# Altium project WT-32 V3.2.PrjPcb (part 1 of 4)
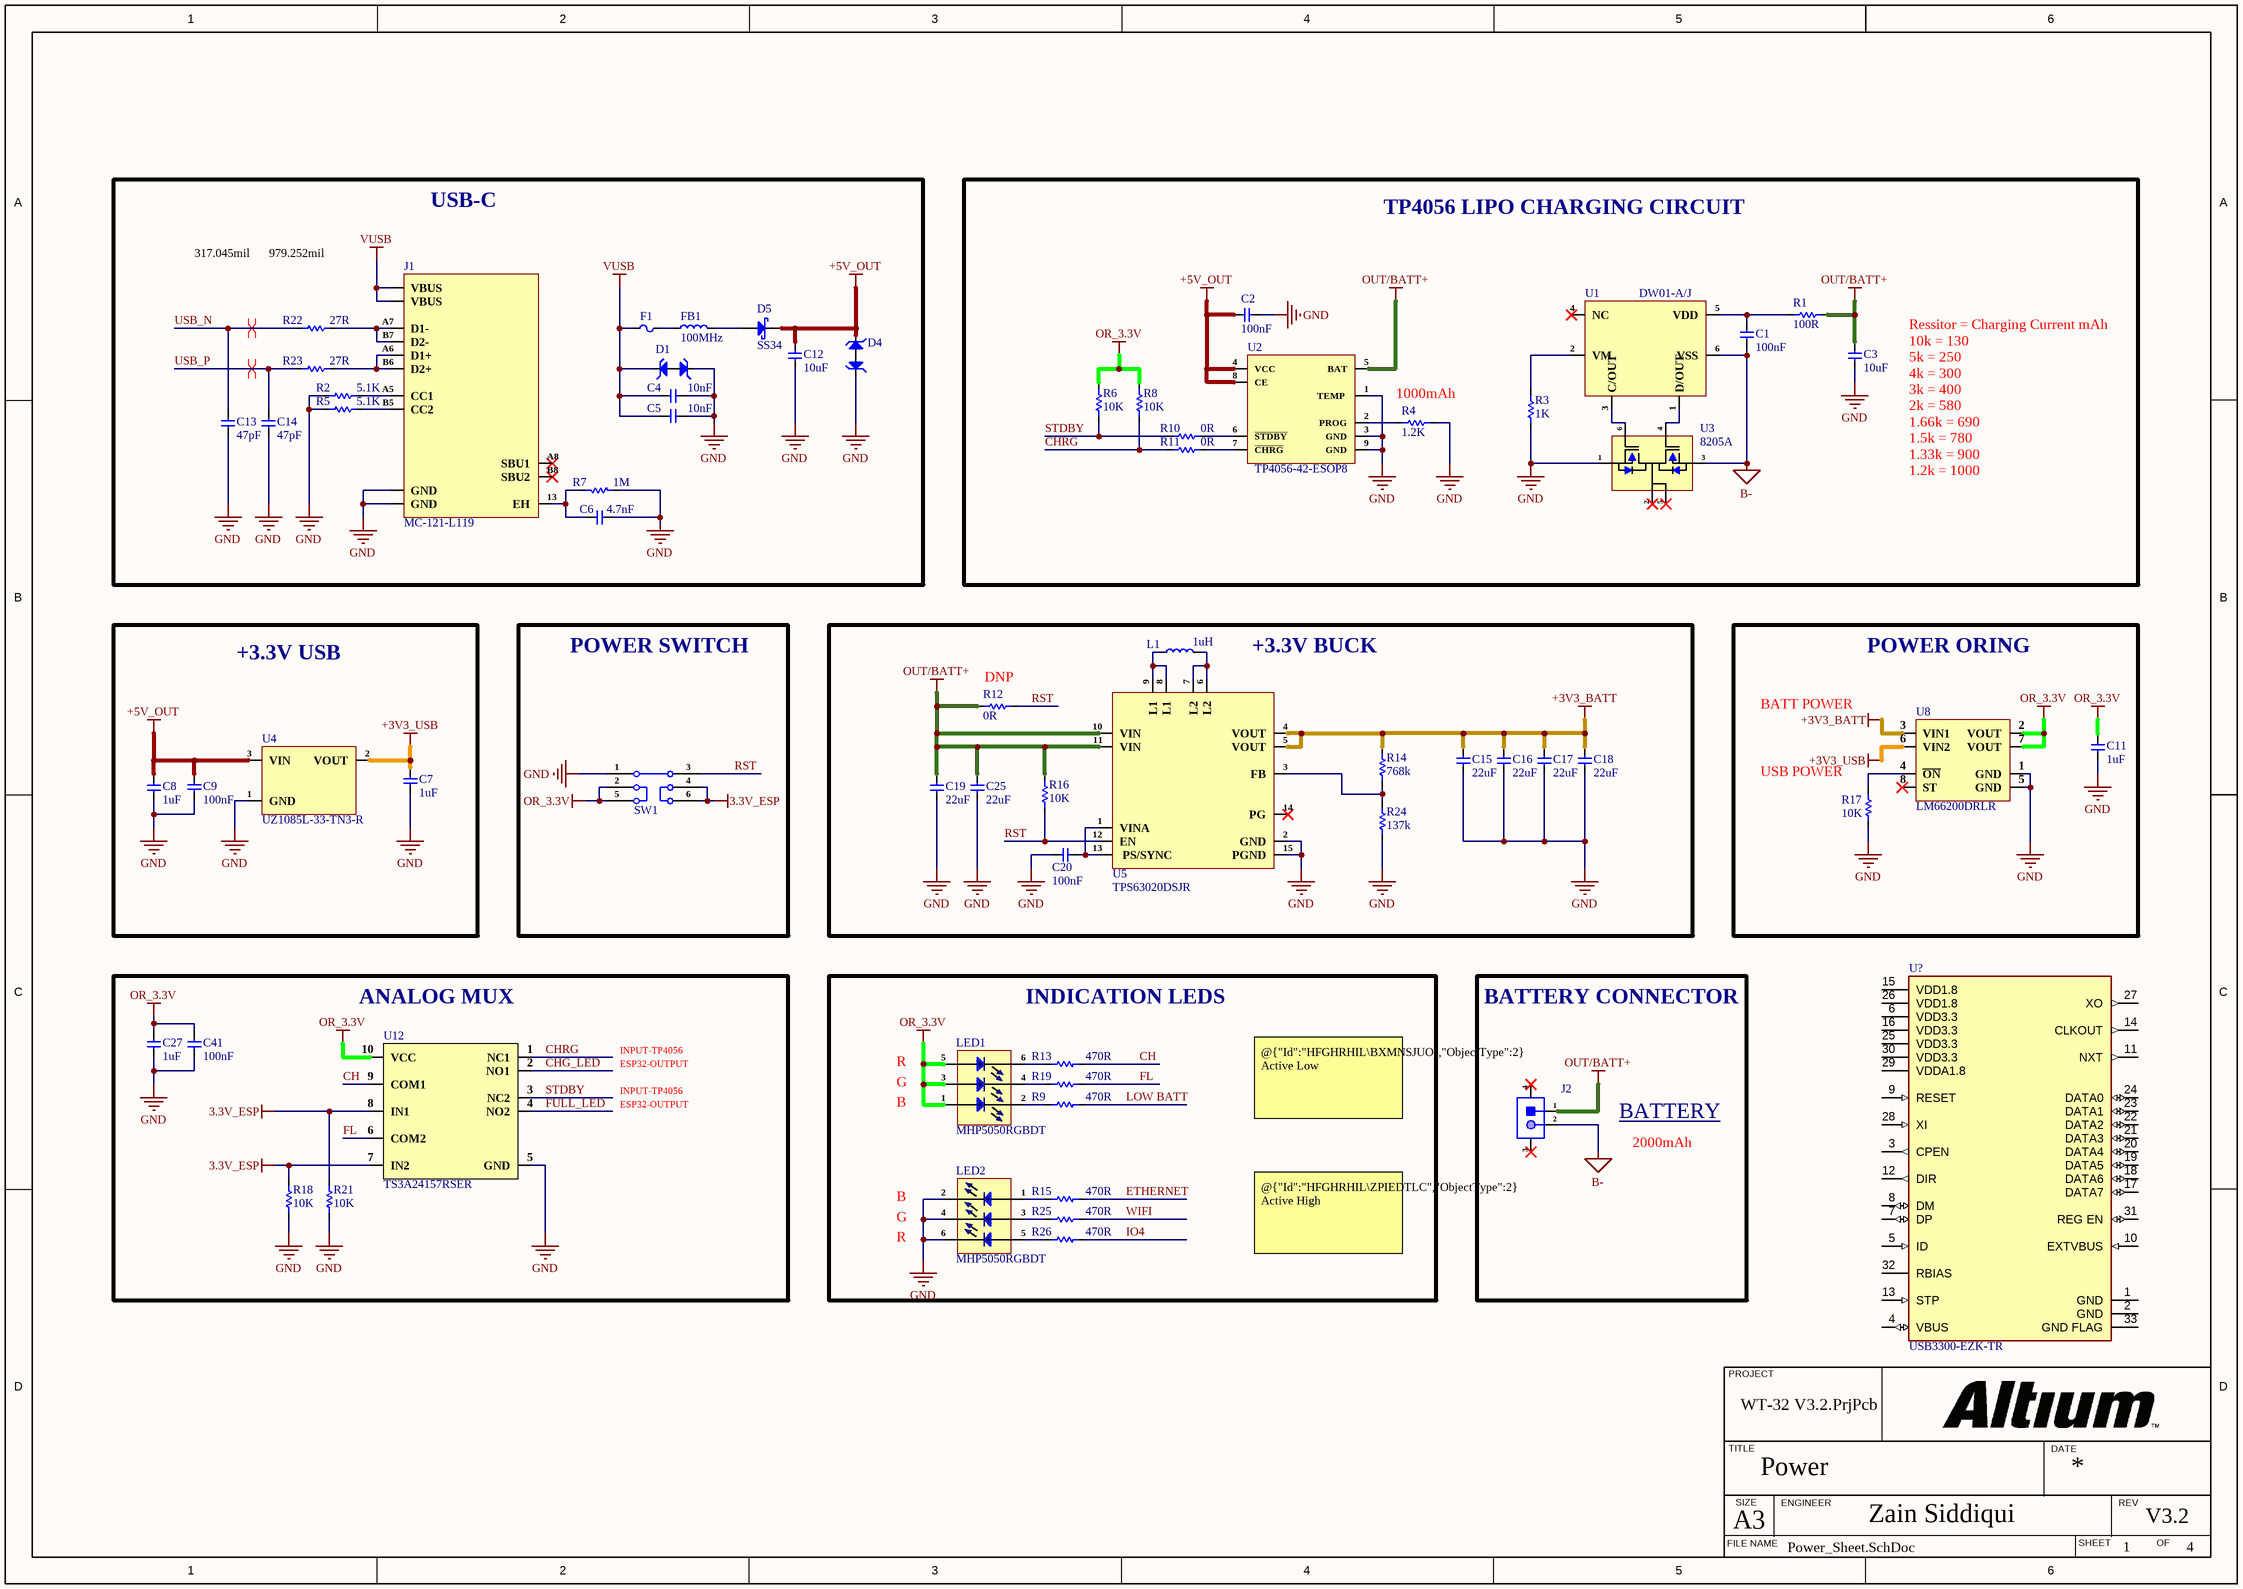
[diagram p0: Power_Sheet.SchDoc]
4 sheets, 124 parts. Net scope: global (net labels, ports and power ports of the same name join across sheets).
Board file: Webbie-V3.2.PcbDoc
Sheets:
  Power_Sheet.SchDoc
  Controller_Sheet.SchDoc
  Ethernet_Sheet.SchDoc
  FuelGauge_Sheet.SchDoc

## Sheet Power_Sheet.SchDoc: Power
size 420 x 297 mm; Engineer: Zain Siddiqui; Revision: V3.2; SheetNumber: 1; SheetTotal: 4

### Parts
C1  100nF  [cap-0402]
C2  100nF  [cap-0402]
C3  10uF  [Cap-0402]
C4  10nF  [Cap-0402]
C5  10nF  [Cap-0402]
C6  4.7nF  [Cap-0402]
C7  1uF  [Cap-0402]
C8  1uF  [Cap-0402]
C9  100nF  [cap-0402]
C11  1uF  [Cap-0402]
C12  10uF  [Cap-0603]
C13  47pF  [Cap-0402]
C14  47pF  [Cap-0402]
C15  22uF  [Cap-0805]
C16  22uF  [Cap-0805]
C17  22uF  [Cap-0805]
C18  22uF  [Cap-0805]
C19  22uF  [Cap-0805]
C20  100nF  [cap-0402]
C25  22uF  [Cap-0805]
C27  1uF  [Cap-0402]
C41  100nF  [cap-0402]
D1  PESD5V0H1BSFYL  [DSN0603-2]  (value not drawn)
D4  PESD5V0H1BSFYL  [DSN0603-2]  (value not drawn)
D5  SS34  [SMA]
F1  BSMD0805L-200  [Fuse-0805]  (value not drawn)
FB1  100MHz  [IND-1206]
J1  MC-121-L119  [MC-121-L119]
J2  S2B-PH-SM4-TB(LF)(SN)  [S2B-PH-SM4-TB(LF)(SN)]  (value not drawn)
L1  1uH  [IND-1008 (2520 Metric)]
LED1  MHP5050RGBDT  [MHP5050RGBDT]
LED2  MHP5050RGBDT  [MHP5050RGBDT]
R1  100R  [RES-0805]
R2  5.1K  [Res-0402]
R3  1K  [Res-0402]
R4  1.2K  [Res-0402]
R5  5.1K  [Res-0402]
R6  10K  [Res-0402]
R7  1M  [Res-0402]
R8  10K  [Res-0402]
R9  470R  [Res-0402]
R10  0R  [Res-0402]
R11  0R  [Res-0402]
R12  0R  [Res-0402]  (no BOM)
R13  470R  [Res-0402]
R14  768k  [Res-0402]
R15  470R  [Res-0402]
R16  10K  [Res-0603]
R17  10K  [Res-0402]
R18  10K  [Res-0402]
R19  470R  [Res-0402]
R21  10K  [Res-0402]
R22  27R  [Res-0402]
R23  27R  [Res-0402]
R24  137k  [Res-0402]
R25  470R  [Res-0402]
R26  470R  [Res-0402]
SW1  TK-6580A8-1  [TK-6580A8-1]  (value not drawn)
U1  DW01-A/J  [SOT-23-6]
U2  TP4056-42-ESOP8  [ESOP-8]
U3  8205A  [SOT-23-6]
U4  UZ1085L-33-TN3-R  [TO-252-2(DPAK)]
U5  TPS63020DSJR  [14-VSON (4x3)]
U8  LM66200DRLR  [SOT8]
U12  TS3A24157RSER  [UQFN-10(1.5x2)]
U?  USB3300-EZK-TR  [FP-32QFN-3304-5X5B-MFG]

### Blocks framed on the sheet
USB-C: C4-C6 C12-C14 D1 D4 D5 F1 FB1 J1 R2 R5 R7 R22 R23
TP4056 LIPO CHARGING CIRCUIT: C1-C3 R1 R3 R4 R6 R8 R10 R11 U1-U3
+3.3V USB: C7-C9 U4
POWER SWITCH: SW1
+3.3V BUCK: C15-C20 C25 L1 R12 R14 R16 R24 U5
POWER ORING: C11 R17 U8
ANALOG MUX: C27 C41 R18 R21 U12
INDICATION LEDS: LED1 LED2 R9 R13 R15 R19 R25 R26

### Nets
3.3V_ESP: R18.1 R21.1 SW1.4 SW1.6 U12.7(IN2) U12.8(IN1)
+3V3_BATT: C15.2 C16.2 C17.2 C18.2 R14.2 U5.4(VOUT) U5.5(VOUT) U8.3(VIN1)
+3V3_USB: C7.2 U4.2(VOUT) U8.6(VIN2)
+5V_OUT: C2.1 C8.2 C9.1 C12.2 D4.2 D5.1(K) U2.4(VCC) U2.8(CE) U4.3(VIN)
B-: C1.2 J2.2 U1.6(VSS) U3.3(S2)
GND: C2.2 C3.1 C4.2 C5.2 C6.1 C7.1 C8.1 C9.2 C11.1 C12.1 C13.1 C14.1 C15.1 C16.1 C17.1 C18.1 C19.1 C20.2 C25.1 C27.1 C41.1 D1.2 D4.1 J1.A1B12(GND) J1.B1A12(GND) LED2.2 LED2.4 LED2.6 R2.1 R3.1 R4.2 R5.1 R7.1 R17.2 R18.2 R21.2 R24.1 SW1.1 U2.1(TEMP) U2.3(GND) U2.9(GND) U3.1(S1) U4.1(GND) U5.2(GND) U5.15(PGND) U8.1(GND) U8.5(GND) U12.5(GND)
OR_3.3V: C11.2 C27.2 C41.2 LED1.1 LED1.3 LED1.5 R6.2 R8.2 SW1.2 SW1.5 U8.2(VOUT) U8.7(VOUT) U12.10(VCC)
OUT/BATT+: C3.2 C19.2 C25.2 J2.1 R1.2 R12.1 R16.2 U2.5(BAT) U5.10(VIN) U5.11(VIN)
VUSB: C4.1 C5.1 D1.1 F1.1 J1.A4B9(VBUS) J1.B4A9(VBUS)
CH: R13.1 U12.9(COM1)
CHG_LED: U12.2(NO1)
CHRG: R8.1 R11.1 U12.1(NC1)
ETHERNET: R15.1
FL: R19.1 U12.6(COM2)
FULL_LED: U12.4(NO2)
IO4: R26.1
LOW BATT: R9.1
RST: R12.2 R16.1 SW1.3 U5.12(EN)
STDBY: R6.1 R10.1 U12.3(NC2)
USB_N: C13.2 R22.1
USB_P: C14.2 R23.1
WIFI: R25.1
NetC1_1: C1.1 R1.1 U1.5(VDD)
NetC6_2: C6.2 J1.13(EH) R7.2
NetC20_1: C20.1 U5.1(VINA) U5.13(PS/SYNC)
NetD5_2: D5.2(A) FB1.2
NetF1_2: F1.2 FB1.1
NetJ1_A5: J1.A5(CC1) R2.2
NetJ1_A6: J1.A6(D1+) J1.B6(D2+) R23.2
NetJ1_A7: J1.A7(D1-) J1.B7(D2-) R22.2
NetJ1_B5: J1.B5(CC2) R5.2
NetL1_1: L1.1 U5.8(L1) U5.9(L1)
NetL1_2: L1.2 U5.6(L2) U5.7(L2)
NetLED1_2: LED1.2 R9.2
NetLED1_4: LED1.4 R19.2
NetLED1_6: LED1.6 R13.2
NetLED2_1: LED2.1 R15.2
NetLED2_3: LED2.3 R25.2
NetLED2_5: LED2.5 R26.2
NetR3_2: R3.2 U1.2(VM)
NetR4_1: R4.1 U2.2(PROG)
NetR10_2: R10.2 U2.6(~{STDBY})
NetR11_2: R11.2 U2.7(~{CHRG})
NetR14_1: R14.1 R24.2 U5.3(FB)
NetR17_1: R17.1 U8.4(~{ON})
NetU1_1: U1.1(D/OUT) U3.4(G2)
NetU1_3: U1.3(C/OUT) U3.6(G1)

Not connected (* = marked no-connect by the designer): J1 A8(SBU1)* B8(SBU2)*; J2 3* 4*; U1 4(NC)*; U3 2(D)* 5(D)*; U5 14(PG)*; U8 8(ST)*; U? 1(GND) 2(GND) 3(CPEN) 4(VBUS) 5(ID) 6(VDD3.3) 7(DP) 8(DM) 9(RESET) 10(EXTVBUS) 11(NXT) 12(DIR) 13(STP) 14(CLKOUT) 15(VDD1.8) 16(VDD3.3) 17(DATA7) 18(DATA6) 19(DATA5) 20(DATA4) 21(DATA3) 22(DATA2) 23(DATA1) 24(DATA0) 25(VDD3.3) 26(VDD1.8) 27(XO) 28(XI) 29(VDDA1.8) 30(VDD3.3) 31(REG_EN) 32(RBIAS) 33(GND_FLAG)

### Layout directives
differential pair; net class USB 90 OHM; differential pair class USB_Lines; rule Matched Net Lengths [Tolerance = 50mil]; rule Impedance Constraint [Min = 85.00    Max = 95.00    ]: USB_N, USB_P

### Notes on the sheet
- 317.045mil
- 979.252mil
- (near R4) 1000mAh
- Ressitor = Charging Current mAh
  10k = 130
  5k = 250
  4k = 300
  3k = 400
  2k = 580
  1.66k = 690
  1.5k = 780
  1.33k = 900
  1.2k = 1000
- (near R12) DNP
- BATT POWER
- (near R17) USB POWER
- BATTERY CONNECTOR
- INPUT-TP4056
- ESP32-OUTPUT
- (near LED1) R
- (near LED1) G
- (near LED1) B
- @{"Id":"HFGHRHIL\BXMNSJUO","ObjectType":2} Active Low
- BATTERY <https://www.amazon.co.uk/EEMB-Lithium-103454RP-Rechargeable-Connector/dp/B0B7N2T1TD/?_encoding=UTF8&pd_rd_w=1Q0Rl&content-id=amzn1.sym.a4ac6c4d-6ae7-4d95-b5e0-812c9dcfc72e%3Aamzn1.symc.fc11ad14-99c1-406b-aa77-051d0ba1aade&pf_rd_p=a4ac6c4d-6ae7-4d95-b5e0-812c9dcfc72e&pf_rd_r=75VE4HDA9VR80FP99FPQ&pd_rd_wg=o1fsp&pd_rd_r=b06b78bc-3f15-4724-b1d2-b5be871d7b56&ref_=pd_hp_d_atf_ci_mcx_mr_ca_hp_atf_d>
- (near LED2) B
- 2000mAh
- (near LED2) R
- (near LED2) G
- @{"Id":"HFGHRHIL\ZPIEDTLC","ObjectType":2} Active High
- PROJECT
- TITLE
- DATE
- FILE NAME
- A3
- SIZE
- ENGINEER
- SHEET
- REV
- OF